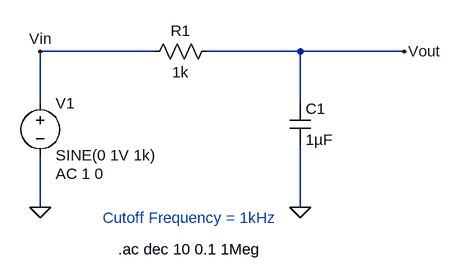
[diagram p0: schematic FirstOrderLPF.asc]
FirstOrderLPF.asc, the LTspice schematic file:
Version 4
SHEET 1 880 680
WIRE 272 48 96 48
WIRE 496 48 352 48
WIRE 656 48 496 48
WIRE 96 128 96 48
WIRE 496 128 496 48
WIRE 96 288 96 208
WIRE 496 288 496 192
FLAG 96 288 0
FLAG 496 288 0
FLAG 96 48 Vin
FLAG 656 48 Vout
SYMBOL voltage 96 112 R0
WINDOW 123 24 124 Left 2
WINDOW 39 0 0 Left 0
SYMATTR Value2 AC 1 0
SYMATTR InstName V1
SYMATTR Value SINE(0 1V 1k)
SYMBOL res 368 32 R90
WINDOW 0 0 56 VBottom 2
WINDOW 3 32 56 VTop 2
SYMATTR InstName R1
SYMATTR Value 1k
SYMBOL cap 480 128 R0
SYMATTR InstName C1
SYMATTR Value 1µF
TEXT 216 352 Left 2 !.ac dec 10 0.1 1Meg
TEXT 192 304 Left 2 ;Cutoff Frequency = 1kHz

The netlist it stands for:
* FirstOrderLPF.asc
V1 Vin 0 SINE(0 1V 1k) AC 1 0
R1 Vout Vin 1k
C1 Vout 0 1µF
.ac dec 10 0.1 1Meg
* Cutoff Frequency = 1kHz
.backanno
.end

* Results of the author's LTspice run, read from the files saved beside the schematic
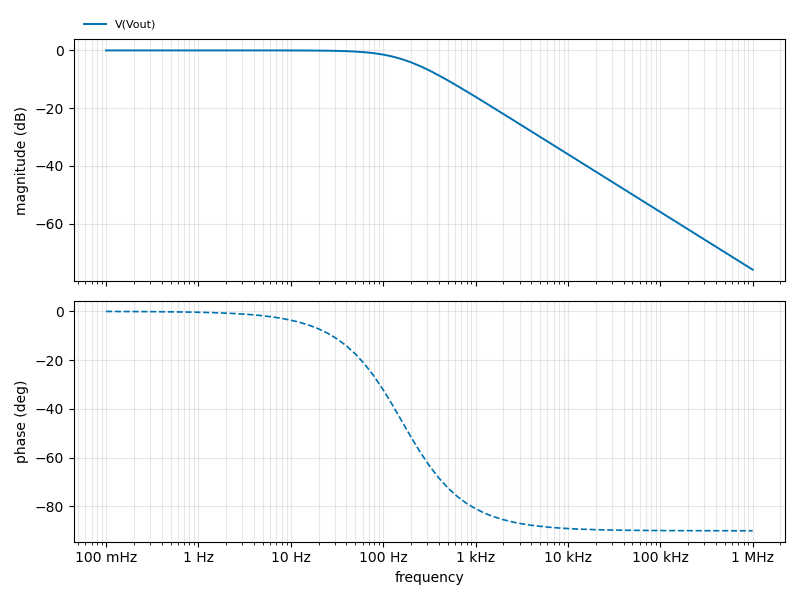
[diagram p1: AC Analysis of FirstOrderLPF.asc, plotted from the saved traces]
* AC Analysis, 1 run:
*   V(Vout): -0.00 dB at 100 mHz, -75.96 dB at 1 MHz, peak -0.00 dB at 100 mHz, 3 dB below the peak at 159.1 Hz